# EAGLE schematic LMC303DLH_breakout (EAGLE 5.09)
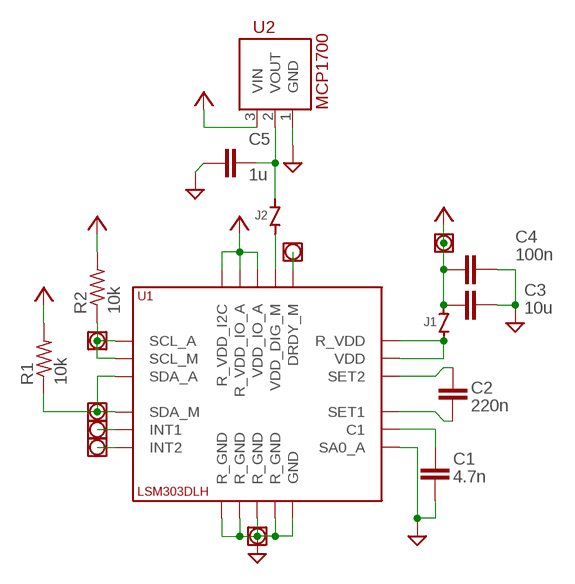
[diagram p0: schematic, sheet 1]

## Parts
C1  4.7n  C-EUC0603  [C0603]
C2  220n  C-EUC0603  [C0603]
C3  10u  C-EUC0805  [C0805]
C4  100n  C-EUC0603  [C0603]
C5  1u  C-EUC0603  [C0603]
DRDY_M  JUMPPAD  [JUMPPAD]
GND-PIN  JUMPPAD  [JUMPPAD]
INT1  JUMPPAD  [JUMPPAD]
INT2  JUMPPAD  [JUMPPAD]
J1  JUMPER_ZEROOHM  [ZJ-0603]
J2  JUMPER_ZEROOHM  [ZJ-0603]
R1  10k  R-US_R0603  [R0603]
R2  10k  R-US_R0603  [R0603]
SCL  JUMPPAD  [JUMPPAD]
SDA  JUMPPAD  [JUMPPAD]
U1  LSM303DLH  [LGA-28L(5X5X1)]
U2  MCP1700  [SOT-23-3]
U$9  JUMPPAD  [JUMPPAD]

## Nets
1.8V: C5.2 J2.2 U2.2(VOUT)
1.87V-JUMP: J2.1 U1.21(VDD_DIG_M)
DRDY_M: DRDY_M.PAD(TP) U1.18(DRDY_M)
GND: C1.2 C3.1 C4.2 C5.1 GND-PIN.PAD(TP) U1.1(R_GND) U1.2(GND) U1.3(R_GND) U1.4(SA0_A) U1.17(R_GND) U1.28(R_GND) U2.1(GND)
INT1: INT1.PAD(TP) U1.26(INT1)
INT2: INT2.PAD(TP) U1.27(INT2)
N$1: C2.2 U1.16(SET1)
N$3: C1.1 U1.15(C1)
N$6: C2.1 U1.12(SET2)
N$14: J1.1 U1.6(VDD) U1.7(R_VDD)
SCL: R2.1 SCL.PAD(TP) U1.20(SCL_M) U1.24(SCL_A)
SDA: R1.1 SDA.PAD(TP) U1.19(SDA_M) U1.25(SDA_A)
VDD: C3.2 C4.1 J1.2 R1.2 R2.2 U1.5(R_VDD_I2C) U1.22(VDD_IO_A) U1.23(R_VDD_IO_A) U2.3(VIN) U$9.PAD(TP)

## Library data of the parts
C1-C5 = rcl:C-EU: CAPACITOR, European symbol
DRDY_M GND-PIN INT1 INT2 SCL SDA U$9 = Compass:JUMPPAD
J1 J2 = Compass:JUMPER_ZEROOHM
R1 R2 = rcl:R-US_: RESISTOR, American symbol
U1 = Compass:LSM303DLH
U2 = Compass:MCP1700